# Altium project PowerDistribution.PrjPcb (part 3 of 6)

## Sheet Power Distribution - Light Load Driver.SchDoc: Light Load Driver
size Letter; Organization: Midnight Sun Solar Rayce Car Team; Address1: University of Waterloo; Address2: 200 University Ave W; Address3: Waterloo, ON, Canada; Address4: N2L 3E9; Website: www.uwmidsun.com; SheetName: Light Load Driver
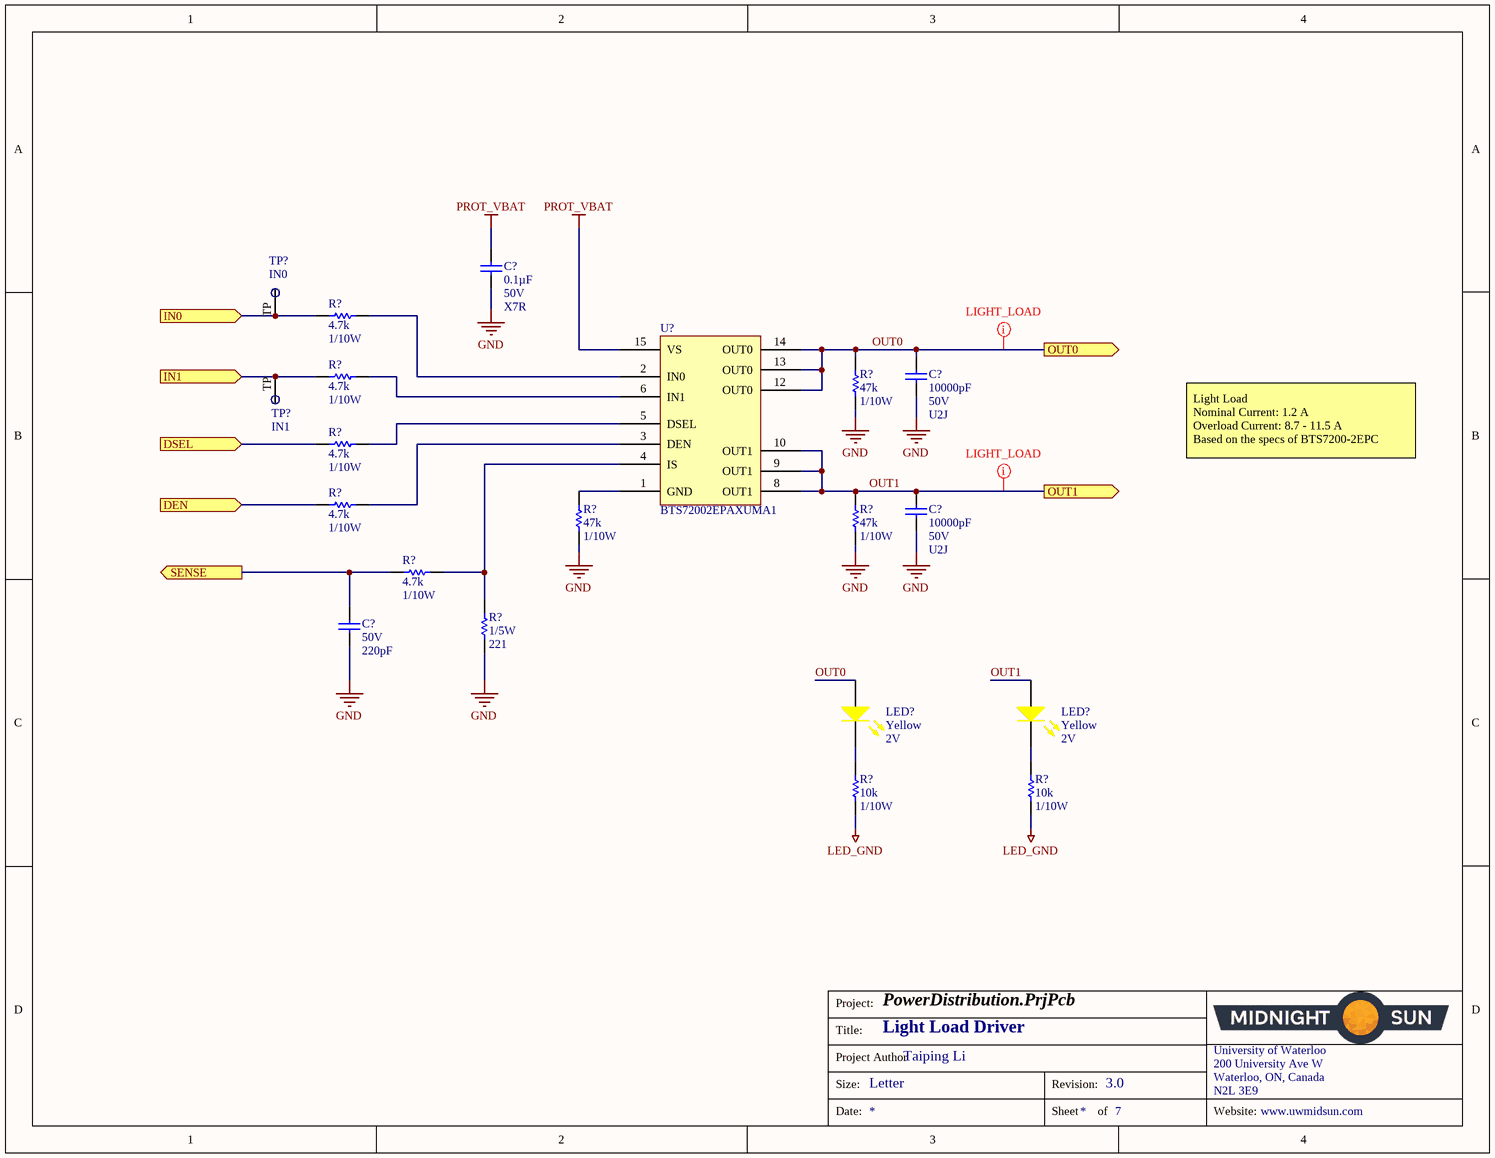
[diagram p5: Power Distribution - Light Load Driver.SchDoc]

### Parts
(Parts that share a designator on the sheet are numbered #1, #2 ... from top to bottom, then left to right.)
C?#4  Capacitance: 0.1µF  Voltage: 50V  Temperature Coefficient: X7R  [CAP, 0603]  (hidden comment: CAP CER 0.1UF 50V 10% X7R 0603)
C?#5  Capacitance: 10000pF  Voltage: 50V  Temperature Coefficient: U2J  [CAP, 0603]  (hidden comment: CAP CER 10nF 50V 5% X7R 0603)
C?#6  Capacitance: 10000pF  Voltage: 50V  Temperature Coefficient: U2J  [CAP, 0603]  (hidden comment: CAP CER 10nF 50V 5% X7R 0603)
C?#7  Voltage Rating: 50V  Capacitance: 220pF  [CAP, 0603]  (hidden comment: CAP CER 220PF 50V C0G/NP0 0603)
LED?#1  Color: Yellow  Voltage - Forward (Vf) (Typ): 2V  [LED_0603]  (hidden comment: LED YELLOW CLEAR 2.1V 0603)
LED?#2  Color: Yellow  Voltage - Forward (Vf) (Typ): 2V  [LED_0603]  (hidden comment: LED YELLOW CLEAR 2.1V 0603)
R?#3  Resistance (Ohms): 4.7k  Power (Watts): 1/10W  [RES, 0603]  (hidden comment: RES 4.7K OHM 1% 1/10W 0603)
R?#4  Resistance: 47k  Power Rating: 1/10W  [RES, 0603]  (hidden comment: RES 47K OHM 1% 1/10W 0603)
R?#5  Resistance (Ohms): 4.7k  Power (Watts): 1/10W  [RES, 0603]  (hidden comment: RES 4.7K OHM 1% 1/10W 0603)
R?#6  Resistance (Ohms): 4.7k  Power (Watts): 1/10W  [RES, 0603]  (hidden comment: RES 4.7K OHM 1% 1/10W 0603)
R?#7  Resistance: 47k  Power Rating: 1/10W  [RES, 0603]  (hidden comment: RES 47K OHM 1% 1/10W 0603)
R?#8  Resistance: 47k  Power Rating: 1/10W  [RES, 0603]  (hidden comment: RES 47K OHM 1% 1/10W 0603)
R?#9  Resistance (Ohms): 4.7k  Power (Watts): 1/10W  [RES, 0603]  (hidden comment: RES 4.7K OHM 1% 1/10W 0603)
R?#10  Resistance (Ohms): 4.7k  Power (Watts): 1/10W  [RES, 0603]  (hidden comment: RES 4.7K OHM 1% 1/10W 0603)
R?#11  Power (Watts): 1/5W  Resistance: 221  [RES, 0603]  (hidden comment: RES 221 OHM 0.1% 1/5W 0603)
R?#12  Resistance: 10k  Power: 1/10W  [RES, 0603]  (hidden comment: RES 10K OHM 1% 1/10W 0603)
R?#13  Resistance: 10k  Power: 1/10W  [RES, 0603]  (hidden comment: RES 10K OHM 1% 1/10W 0603)
TP?#2  IN0  [Test Point]  (no BOM)
TP?#3  IN1  [Test Point]  (no BOM)
U?#4  Manufacturer Part Number: BTS72002EPAXUMA1  [IC LOAD SWITCH PG-TSDSO-14-22]  (hidden comment: IC LOAD SWITCH BTS7200-2EPA PG-TSDSO-14)

### Ports
DEN (in), DSEL (in), IN0 (in), IN1 (in), OUT0 (out), OUT1 (out), SENSE (out)

### Nets
GND: C?#4.2 C?#5.2 C?#6.2 C?#7.2 R?#4.2 R?#7.2 R?#8.2 R?#11.2
LED_GND: R?#12.2 R?#13.2
PROT_VBAT: C?#4.1 U?#4.15(VS)
OUT0: C?#5.1 LED?#1.1(A) R?#4.1 U?#4.12(OUT0) U?#4.13(OUT0) U?#4.14(OUT0) ; port OUT0
OUT1: C?#6.1 LED?#2.1(A) R?#8.1 U?#4.8(OUT1) U?#4.9(OUT1) U?#4.10(OUT1) ; port OUT1
NetC?#7_1: C?#7.1 R?#10.1 ; port SENSE
NetLED?#1_2: LED?#1.2(K) R?#12.1
NetLED?#2_2: LED?#2.2(K) R?#13.1
NetR?#3_1: R?#3.1 TP?#2.TP ; port IN0
NetR?#3_2: R?#3.2 U?#4.2(IN0)
NetR?#5_1: R?#5.1 TP?#3.TP ; port IN1
NetR?#5_2: R?#5.2 U?#4.6(IN1)
NetR?#6_1: R?#6.1 ; port DSEL
NetR?#6_2: R?#6.2 U?#4.5(DSEL)
NetR?#7_1: R?#7.1 U?#4.1(GND)
NetR?#9_1: R?#9.1 ; port DEN
NetR?#9_2: R?#9.2 U?#4.3(DEN)
NetR?#10_2: R?#10.2 R?#11.1 U?#4.4(IS)

### Layout directives
mark named LIGHT_LOAD: OUT0, OUT1

### Notes on the sheet
- Light Load
  Nominal Current: 1.2 A
  Overload Current: 8.7 - 11.5 A
  Based on the specs of BTS7200-2EPC
- Project:
- Title:
- Size:
- Project Author
- Letter
- Revision:
- University of Waterloo
- 200 University Ave W
- Waterloo, ON, Canada
- N2L 3E9
- Date:
- Sheet
- of
- Website:

### Library data of the parts
C?#4 = CAP CER 0.1UF 50V 10% X7R 0603: 0.10µF ±10% 50V Ceramic Capacitor X7R 0603 (1608 Metric); Manufacturer 1: AVX Corporation; Manufacturer Part Number 1: 06035C104KAT2A; Supplier 1: Digi-Key; Supplier Part Number 1: 478-5052-1-ND; Packaging: Cut Tape (CT); Part Status: Active; Operating Temperature: -55°C ~ 125°C; Ratings: -; Mounting Type: Surface Mount, MLCC; Package / Case: 0603 (1608 Metric); Size / Dimension: 0.063" L x 0.032" W (1.60mm x 0.81mm); Height - Seated (Max): -; Thickness (Max): 0.035" (0.90mm); Lead Spacing: -; Lead Style: -; ComponentLink1URL: http://datasheets.avx.com/X7RDielectric.pdf; ComponentLink1Description: http://datasheets.avx.com/X7RDielectric.pdf; Tolerance: ±10%
C?#5 C?#6 = CAP CER 10nF 50V 5% X7R 0603: 10000pF ±5% 50V Ceramic Capacitor U2J 0603 (1608 Metric); Manufacturer 1: KEMET; Manufacturer Part Number 1: C0603C103J5JAC7867; Supplier 1: Digi-Key; Supplier Part Number 1: 399-13384-1-ND; Packaging: Cut Tape (CT); Part Status: Active; Operating Temperature: -55°C ~ 125°C; Ratings: -; Failure Rate: -; Mounting Type: Surface Mount, MLCC; Package / Case: 0603 (1608 Metric); Size / Dimension: 0.063" L x 0.032" W (1.60mm x 0.80mm); Height - Seated (Max): -; Thickness (Max): 0.034" (0.87mm); Lead Spacing: -; Lead Style: -; ComponentLink1URL: http://www.kemet.com/docfinder?Partnumber=C0603C103J5JAC7867; ComponentLink1Description: http://www.kemet.com/docfinder?Partnumber=C0603C103J5JAC7867; Tolerance: ±5%
C?#7 = CAP CER 220PF 50V C0G/NP0 0603: 220pF ±5% 50V Ceramic Capacitor C0G, NP0 0603 (1608 Metric); Manufacturer: KEMET; Manufacturer Part Number: C0603C221J5GACAUTO; Dissipation Factor: 0.1%; Supplier 1: Digi-Key; Supplier Part Number 1: 399-6868-1-ND; Stock 1: 35170; Pricing 1: 1=0.14000, 10=0.09700, 100=0.04550, 500=0.03188, 1000=0.02640 (USD); RoHS: Yes; Mount: Surface Mount; Case/Package: 0603; Case Code (Metric): 1608; Case Code (Imperial): 0603; Contact Plating: Tin; Dielectric Material: Ceramic; Min Operating Temperature: -55°C; Max Operating Temperature: 125°C; Tolerance: 5%; Packaging: Tape and Reel; Package Quantity: 1; Voltage Rating (DC): 50V; Termination: SMD/SMT; Length: 1.6mm; Height: 0.8mm; Width: 0.031inch; Thickness: 0.034inch; Depth: 0.8mm; Ratings: AEC-Q200; Radiation Hardening: No; REACH SVHC: No SVHC; Lead Free: Lead Free; ComponentLink1URL: https://datasheet.ciiva.com/18192/getdatasheetpartid-416741-18192869.pdf?src-supplier=Verical; ComponentLink1Description: https://datasheet.ciiva.com/18192/getdatasheetpartid-416741-18192869.pdf?src-supplier=Verical; ComponentLink2URL: https://datasheet.ciiva.com/22694/1633156-22694015.pdf?src-supplier=Element14; ComponentLink2Description: https://datasheet.ciiva.com/22694/1633156-22694015.pdf?src-supplier=Element14; Dielectric: C0G
LED?#1 LED?#2 = LED YELLOW CLEAR 2.1V 0603: Yellow 590nm LED Indication - Discrete 2V 0603 (1608 Metric); Manufacturer: Wurth Electronics Inc.; Manufacturer Part Number: 150060YS75000; Lens Color: Colorless; Millicandela Rating: 120mcd; Lens Style/Size: Rectangle with Flat Top, 1.10mm x 0.70mm; Current - Test: 20mA; Viewing Angle: 140°; Wavelength - Peak: 595nm; Supplier 1: Digi-Key; RoHS: RoHS Compliant; Category: Optoelectronics; Stock 1: 10523; Pricing 1: 1=0.21, 100=0.1617, 500=0.13964 (CAD); Packaging: Cut Tape (CT); Part Status: Active; Lens Transparency: Clear; Mounting Type: Surface Mount; Wavelength - Dominant: 590nm; Features: -; Package / Case: 0603 (1608 Metric); Supplier Device Package: 0603; Size / Dimension: 1.60mm L x 0.80mm W; Height (Max): 0.80mm; ComponentLink1URL: http://katalog.we-online.de/led/datasheet/150060YS75000.pdf; ComponentLink1Description: http://katalog.we-online.de/led/datasheet/150060YS75000.pdf; Supplier Part Number 1: 732-4981-1-ND
R?#3 R?#5 R?#6 R?#9 R?#10 = RES 4.7K OHM 1% 1/10W 0603: 4.7k Ohm ±1% 0.1W, 1/10W Chip Resistor 0603 (1608 Metric) Moisture Resistant Thick Film; Manufacturer 1: Yageo; Manufacturer Part Number 1: RC0603FR-074K7L; Description 1: RES SMD 4.7K OHM 1% 1/10W 0603; Temperature Coefficient: ±100ppm/°C; Supplier 1: Digi-Key; Supplier Part Number 1: 311-4.70KHRCT-ND; RoHS: RoHS Compliant; Category: Resistors; Stock 1: 3487566; Pricing 1: 1=0.16, 10=0.022, 100=0.0089, 1000=0.00402, 2500=0.00349 (CAD); Packaging: Cut Tape (CT); Part Status: Active; Composition: Thick Film; Features: Moisture Resistant; Operating Temperature: -55°C ~ 155°C; Package / Case: 0603 (1608 Metric); Supplier Device Package: 0603; Size / Dimension: 0.063" L x 0.031" W (1.60mm x 0.80mm); Height - Seated (Max): 0.022" (0.55mm); Failure Rate: -; ComponentLink1URL: http://www.yageo.com/documents/recent/PYu-RC_Group_51_RoHS_L_7.pdf; ComponentLink1Description: http://www.yageo.com/documents/recent/PYu-RC_Group_51_RoHS_L_7.pdf; Tolerance: ±1%
R?#4 R?#7 R?#8 = RES 47K OHM 1% 1/10W 0603: 47 kOhms ±1% 0.1W, 1/10W Chip Resistor 0603 (1608 Metric) Automotive AEC-Q200 Thick Film; Manufacturer: Panasonic; Manufacturer Part Number: ERJ3EKF4702V; Voltage Rating: 75V; Temperature Coefficient: 100ppm/°C; Working Voltage: 6V; Max Power Dissipation: 100mW; ComponentLink1URL: https://industrial.panasonic.com/cdbs/www-data/pdf/RDO0000/AOA0000C291.pdf; ComponentLink1Description: https://industrial.panasonic.com/cdbs/www-data/pdf/RDO0000/AOA0000C291.pdf; ComponentLink2URL: https://datasheet.ciiva.com/6138/aoa0000ce2-6138149.pdf?src-supplier=Farnell; ComponentLink2Description: https://datasheet.ciiva.com/6138/aoa0000ce2-6138149.pdf?src-supplier=Farnell; ComponentLink3URL: https://datasheet.ciiva.com/7802/aoa0000ce2-7802421.pdf?src-supplier=Element14; ComponentLink3Description: https://datasheet.ciiva.com/7802/aoa0000ce2-7802421.pdf?src-supplier=Element14; ComponentLink4URL: https://datasheet.ciiva.com/48531/aoa0000ce2-48531029.pdf?src-supplier=Avnet; ComponentLink4Description: https://datasheet.ciiva.com/48531/aoa0000ce2-48531029.pdf?src-supplier=Avnet; ComponentLink5URL: https://datasheet.ciiva.com/16514/aoa0000ce2-16514071.pdf?src-supplier=Avnet+Asia; ComponentLink5Description: https://datasheet.ciiva.com/16514/aoa0000ce2-16514071.pdf?src-supplier=Avnet+Asia; ComponentLink6URL: https://datasheet.ciiva.com/46398/1678782-46398088.pdf?src-supplier=Element14; ComponentLink6Description: https://datasheet.ciiva.com/46398/1678782-46398088.pdf?src-supplier=Element14; ComponentLink7URL: https://datasheet.ciiva.com/24069/aoa0000ce2-24069209.pdf?src-supplier=Mouser; ComponentLink7Description: https://datasheet.ciiva.com/24069/aoa0000ce2-24069209.pdf?src-supplier=Mouser; ComponentLink8URL: https://datasheet.ciiva.com/46398/1678782-46398089.pdf?src-supplier=Element14; ComponentLink8Description: https://datasheet.ciiva.com/46398/1678782-46398089.pdf?src-supplier=Element14; ComponentLink9URL: https://datasheet.ciiva.com/30236/aoa0000ce2-30236698.pdf?src-supplier=Onlinecomponents.com; ComponentLink9Description: https://datasheet.ciiva.com/30236/aoa0000ce2-30236698.pdf?src-supplier=Onlinecomponents.com; ComponentLink10URL: https://datasheet.ciiva.com/22722/426256-22722781.pdf?src-supplier=Element14; ComponentLink10Description: https://datasheet.ciiva.com/22722/426256-22722781.pdf?src-supplier=Element14; ComponentLink11URL: https://datasheet.ciiva.com/16758/70260748-16758831.pdf?src-supplier=Allied+Electronics; ComponentLink11Description: https://datasheet.ciiva.com/16758/70260748-16758831.pdf?src-supplier=Allied+Electronics; Supplier 1: Digi-Key; Stock 1: 1704740; Pricing 1: 1 = 0.100000, 10 = 0.065000, 100 = 0.026400, 1000 = 0.011860, 2500 = 0.010290 (USD); RoHS: Yes; Mount: Surface Mount; Case/Package: 0603; Number of Pins: 2; Case Code (Metric): 1608; Case Code (Imperial): 0603; Contact Plating: Tin; Min Operating Temperature: -55°C; Max Operating Temperature: 155°C; Tolerance: 1%; Packaging: Tape and Reel; Package Quantity: 1; Composition: Thick Film; Number of Terminations: 2; Termination: SMD/SMT; Military Standard: Not; Voltage Rating (DC): 75V; Features: Automotive AEC-Q200; Length: 1.6mm; Height: 0.022inch; Width: 0.031inch; Depth: 0.8mm; Radiation Hardening: No; REACH SVHC: No SVHC; Lead Free: Lead Free; Supplier Part Number 1: P47.0KHCT-ND
R?#11 = RES 221 OHM 0.1% 1/5W 0603: 221 Ohms ±0.1% 0.2W, 1/5W Chip Resistor 0603 (1608 Metric) Automotive AEC-Q200, Pulse Withstanding Thick Film; Manufacturer: Panasonic; Manufacturer Part Number: ERJ-PB3B2210V; Max Power Dissipation: 200mW; Temperature Coefficient: 50ppm/°C; Supplier 1: Digi-Key; Supplier Part Number 1: P19895CT-ND; Stock 1: 4900; Pricing 1: 1=0.25000, 10=0.21100, 25=0.15320, 50=0.11100, 100=0.08230, 250=0.06316, 500=0.04976, 1000=0.03445 (USD); RoHS: Yes; Case/Package: 0603; Case Code (Metric): 1608; Case Code (Imperial): 0603; Min Operating Temperature: -55°C; Max Operating Temperature: 155°C; Packaging: Cut Tape; Composition: Thick Film; Number of Terminations: 2; Tolerance: 0.1%; Features: Automotive AEC-Q200; Length: 0.063inch; Width: 0.032inch; Height - Seated (Max): 0.022inch; ComponentLink1URL: https://industrial.panasonic.com/cdbs/www-data/pdf/RDM0000/DMM0000COL5.pdf?src-supplier=Digi-Key; ComponentLink1Description: https://industrial.panasonic.com/cdbs/www-data/pdf/RDM0000/DMM0000COL5.pdf?src-supplier=Digi-Key; ComponentLink2URL: https://industrial.panasonic.com/sa/system/files/data/download/catalog/id_fixed-resistors_e_2.pdf?src-supplier=Digi-Key; ComponentLink2Description: https://industrial.panasonic.com/sa/system/files/data/download/catalog/id_fixed-resistors_e_2.pdf?src-supplier=Digi-Key
R?#12 R?#13 = RES 10K OHM 1% 1/10W 0603: RES SMD 10K OHM 1% 1/10W 0603; Manufacturer 1: Yageo; Manufacturer Part Number 1: RC0603FR-0710KL; Temperature Coefficient: ±100ppm/°C; Supplier 1: Digi-Key; Supplier Part Number 1: 311-10.0KHRCT-ND; Packaging: Cut Tape (CT); Part Status: Active; Composition: Thick Film; Operating Temperature: -55°C ~ 155°C; Package / Case: 0603 (1608 Metric); Supplier Device Package: 0603; Size / Dimension: 0.063" L x 0.031" W (1.60mm x 0.80mm); Height - Seated (Max): 0.022" (0.55mm); Failure Rate: -; ComponentLink1URL: http://www.yageo.com/documents/recent/PYu-RC_Group_51_RoHS_L_7.pdf; ComponentLink1Description: http://www.yageo.com/documents/recent/PYu-RC_Group_51_RoHS_L_7.pdf; Tolerance: ±1%
TP?#2 TP?#3 = Test Point
U?#4 = IC LOAD SWITCH BTS7200-2EPA PG-TSDSO-14: Power Switch/Driver 1:1 N-Channel 1.2A PG-TSDSO-14-22; Manufacturer: Infineon; Supplier 1: Digi-Key; Supplier Part Number 1: BTS72002EPAXUMA1CT-ND; Stock 1: 1973; Pricing 1: 1=1.31000, 10=1.17500, 100=0.91640, 500=0.75700, 1000=0.59763 (USD); RoHS: No; ComponentLink1Description: https://www.infineon.com/dgdl/Infineon-BTS7200-2EPA-DS-v01_00-EN.pdf?fileId=5546d462636cc8fb016421e548a61215; ComponentLink1URL: https://www.infineon.com/dgdl/Infineon-BTS7200-2EPA-DS-v01_00-EN.pdf?fileId=5546d462636cc8fb016421e548a61215

## Sheet Power Distribution - Heavy Load Driver.SchDoc
size 254 x 203 mm; Organization: Midnight Sun Solar Rayce Car Team; Address1: University of Waterloo; Address2: 200 University Ave W; Address3: Waterloo, ON, Canada; Address4: N2L 3E9; Website: www.uwmidsun.com
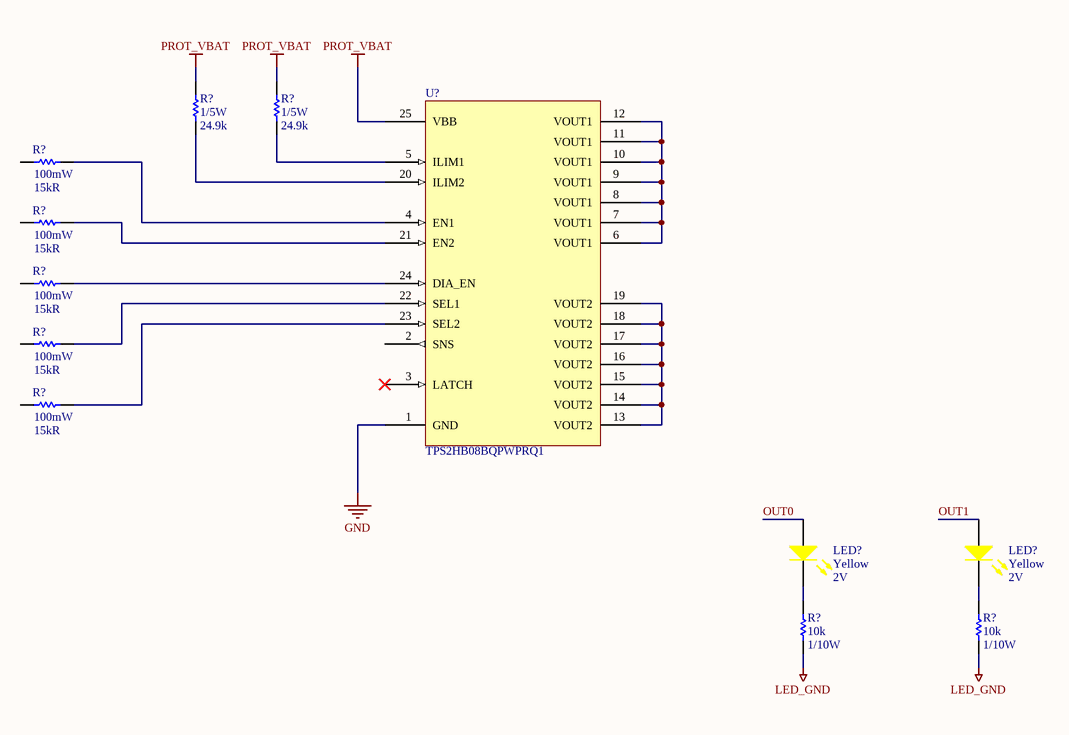
[diagram p6: Power Distribution - Heavy Load Driver.SchDoc]

### Parts
(Parts that share a designator on the sheet are numbered #1, #2 ... from top to bottom, then left to right.)
LED?#3  Color: Yellow  Voltage - Forward (Vf) (Typ): 2V  [LED_0603]  (hidden comment: LED YELLOW CLEAR 2.1V 0603)
LED?#4  Color: Yellow  Voltage - Forward (Vf) (Typ): 2V  [LED_0603]  (hidden comment: LED YELLOW CLEAR 2.1V 0603)
R?#14  Power: 1/5W  Resistance: 24.9k  [RES, 0603]  (hidden comment: RES 24.9K OHM 0.1% 1/5W 0603)
R?#15  Power: 1/5W  Resistance: 24.9k  [RES, 0603]  (hidden comment: RES 24.9K OHM 0.1% 1/5W 0603)
R?#16  Power Rating: 100mW  Resistance: 15kR  [RES, 0603]  (hidden comment: RES SMD 15K OHM 1% 1/10W 0603)
R?#17  Power Rating: 100mW  Resistance: 15kR  [RES, 0603]  (hidden comment: RES SMD 15K OHM 1% 1/10W 0603)
R?#18  Power Rating: 100mW  Resistance: 15kR  [RES, 0603]  (hidden comment: RES SMD 15K OHM 1% 1/10W 0603)
R?#19  Power Rating: 100mW  Resistance: 15kR  [RES, 0603]  (hidden comment: RES SMD 15K OHM 1% 1/10W 0603)
R?#20  Power Rating: 100mW  Resistance: 15kR  [RES, 0603]  (hidden comment: RES SMD 15K OHM 1% 1/10W 0603)
R?#21  Resistance: 10k  Power: 1/10W  [RES, 0603]  (hidden comment: RES 10K OHM 1% 1/10W 0603)
R?#22  Resistance: 10k  Power: 1/10W  [RES, 0603]  (hidden comment: RES 10K OHM 1% 1/10W 0603)
U?#5  Manufacturer Part Number: TPS2HB08BQPWPRQ1  [IC TPS2HB08-Q1 PowerPAD TSSOP-24]  (hidden comment: IC LOAD SWITCH TPS2HB08BQPWPRQ1 24-TSSOP)

### Nets
GND: U?#5.1(GND)
LED_GND: R?#21.2 R?#22.2
PROT_VBAT: R?#14.2 R?#15.2 U?#5.25(VBB)
OUT0: LED?#3.1(A)
OUT1: LED?#4.1(A)
NetLED?#3_2: LED?#3.2(K) R?#21.1
NetLED?#4_2: LED?#4.2(K) R?#22.1
NetR?#14_1: R?#14.1 U?#5.20(ILIM2)
NetR?#15_1: R?#15.1 U?#5.5(ILIM1)
NetR?#16_2: R?#16.2 U?#5.4(EN1)
NetR?#17_2: R?#17.2 U?#5.21(EN2)
NetR?#18_2: R?#18.2 U?#5.24(DIA_EN)
NetR?#19_2: R?#19.2 U?#5.22(SEL1)
NetR?#20_2: R?#20.2 U?#5.23(SEL2)
NetU?#5_6: U?#5.6(VOUT1) U?#5.7(VOUT1) U?#5.8(VOUT1) U?#5.9(VOUT1) U?#5.10(VOUT1) U?#5.11(VOUT1) U?#5.12(VOUT1)
NetU?#5_13: U?#5.13(VOUT2) U?#5.14(VOUT2) U?#5.15(VOUT2) U?#5.16(VOUT2) U?#5.17(VOUT2) U?#5.18(VOUT2) U?#5.19(VOUT2)

Not connected (* = marked no-connect by the designer): R?#16 1; R?#17 1; R?#18 1; R?#19 1; R?#20 1; U?#5 2(SNS) 3(LATCH)*

### Notes on the sheet
- Project:
- Title:
- Size:
- Project Author
- Letter
- Revision:
- University of Waterloo
- 200 University Ave W
- Waterloo, ON, Canada
- N2L 3E9
- Date:
- Sheet
- of
- Website:

### Library data of the parts
LED?#3 LED?#4 = LED YELLOW CLEAR 2.1V 0603: as LED?#1 on sheet Power Distribution - Light Load Driver; Supplier 1: Digi-Key; RoHS: RoHS Compliant; Category: Optoelectronics; Stock 1: 10523; Pricing 1: 1=0.21, 100=0.1617, 500=0.13964 (CAD); Packaging: Cut Tape (CT); Part Status: Active; Lens Transparency: Clear; Mounting Type: Surface Mount; Wavelength - Dominant: 590nm; Features: -; Package / Case: 0603 (1608 Metric); Supplier Device Package: 0603; Size / Dimension: 1.60mm L x 0.80mm W; Height (Max): 0.80mm; ComponentLink1URL: http://katalog.we-online.de/led/datasheet/150060YS75000.pdf; ComponentLink1Description: http://katalog.we-online.de/led/datasheet/150060YS75000.pdf; Supplier Part Number 1: 732-4981-1-ND
R?#14 R?#15 = RES 24.9K OHM 0.1% 1/5W 0603: 24.9 kOhms ±0.1% 0.2W, 1/5W Chip Resistor 0603 (1608 Metric) Automotive AEC-Q200, Pulse Withstanding Thick Film; Manufacturer: Panasonic; Manufacturer Part Number: ERJPB3B2492V; Max Power Dissipation: 200mW; Temperature Coefficient: 50ppm/°C; Supplier 1: Digi-Key; Supplier Part Number 1: P20129CT-ND; Stock 1: 2; Pricing 1: 1=0.25000, 10=0.21100, 25=0.15320, 50=0.11100, 100=0.08230, 250=0.06316, 500=0.04976, 1000=0.03445 (USD); RoHS: Yes; Case/Package: 0603; Case Code (Metric): 1608; Case Code (Imperial): 0603; Min Operating Temperature: -55°C; Max Operating Temperature: 155°C; Packaging: Tape and Reel; Composition: Thick Film; Number of Terminations: 2; Tolerance: 0.1%; Features: Automotive AEC-Q200; Length: 0.063inch; Width: 0.032inch; Height - Seated (Max): 0.022inch; ComponentLink1URL: http://www.farnell.com/datasheets/2286937.pdf?src-supplier=Farnell; ComponentLink1Description: http://www.farnell.com/datasheets/2286937.pdf?src-supplier=Farnell; ComponentLink2URL: https://industrial.panasonic.com/sa/system/files/data/download/catalog/id_fixed-resistors_e_2.pdf?src-supplier=Digi-Key; ComponentLink2Description: https://industrial.panasonic.com/sa/system/files/data/download/catalog/id_fixed-resistors_e_2.pdf?src-supplier=Digi-Key; ComponentLink3URL: https://industrial.panasonic.com/cdbs/www-data/pdf/RDM0000/DMM0000COL5.pdf?src-supplier=Digi-Key; ComponentLink3Description: https://industrial.panasonic.com/cdbs/www-data/pdf/RDM0000/DMM0000COL5.pdf?src-supplier=Digi-Key; ComponentLink4URL: http://www.farnell.com/datasheets/2286937.pdf?src-supplier=Newark; ComponentLink4Description: http://www.farnell.com/datasheets/2286937.pdf?src-supplier=Newark
R?#16-R?#20 = RES SMD 15K OHM 1% 1/10W 0603: 15 kOhms ±1% 0.1W, 1/10W Chip Resistor 0603 (1608 Metric) Moisture Resistant Thick Film; Manufacturer: Yageo; Manufacturer Part Number: RC0603FR-0715KL; Temperature Coefficient: 100ppm/°C; Voltage Rating (DC): 50V; Supplier 1: Digi-Key; RoHS: Yes; Stock 1: 8520111; Pricing 1: 1 = 0.10000, 10 = 0.02400, 100 = 0.00970, 1000 = 0.00437, 2500 = 0.00379 (USD); Case/Package: 0603; Number of Pins: 2; Case Code (Metric): 1608; Case Code (Imperial): 0603; Min Operating Temperature: -55°C; Max Operating Temperature: 155°C; Tolerance: 1%; Packaging: Tape and Reel; Composition: Thick Film; Package Quantity: 1; Voltage Rating: 50V; Number of Terminations: 2; Termination: SMD/SMT; Military Standard: Not; Max Power Dissipation: 100mW; Features: Moisture Resistant; Length: 1.6mm; Height: 0.022inch; Width: 0.031inch; Depth: 0.8mm; REACH SVHC: Unknown; Lead Free: Lead Free; ComponentLink1URL: http://www.yageo.com/documents/recent/PYu-RC_Group_51_RoHS_L_10.pdf; ComponentLink1Description: http://www.yageo.com/documents/recent/PYu-RC_Group_51_RoHS_L_10.pdf; ComponentLink2URL: http://www.yageo.com/documents/recent/PYu-RC_Group_51_RoHS_L_9.pdf; ComponentLink2Description: http://www.yageo.com/documents/recent/PYu-RC_Group_51_RoHS_L_9.pdf; ComponentLink3URL: https://www.verical.com/server-webapp/html/getDatasheet?partID=327895; ComponentLink3Description: https://www.verical.com/server-webapp/html/getDatasheet?partID=327895; Supplier Part Number 1: 311-15.0KHRCT-ND
R?#21 R?#22 = RES 10K OHM 1% 1/10W 0603: as R?#12 on sheet Power Distribution - Light Load Driver; Supplier 1: Digi-Key; Supplier Part Number 1: 311-10.0KHRCT-ND; Packaging: Cut Tape (CT); Part Status: Active; Composition: Thick Film; Operating Temperature: -55°C ~ 155°C; Package / Case: 0603 (1608 Metric); Supplier Device Package: 0603; Size / Dimension: 0.063" L x 0.031" W (1.60mm x 0.80mm); Height - Seated (Max): 0.022" (0.55mm); Failure Rate: -; ComponentLink1URL: http://www.yageo.com/documents/recent/PYu-RC_Group_51_RoHS_L_7.pdf; ComponentLink1Description: http://www.yageo.com/documents/recent/PYu-RC_Group_51_RoHS_L_7.pdf; Tolerance: ±1%
U?#5 = IC LOAD SWITCH TPS2HB08BQPWPRQ1 24-TSSOP: Power Switch ICs - Power Distribution HYDRA 8 MOHM OTP B; Manufacturer: Texas Instruments; Supplier 1: Mouser; Supplier Part Number 1: 595-TPS2HB08BQPWPRQ1; Stock 1: 1455; Pricing 1: 1=6.26000, 10=5.63000, 50=5.63000, 100=4.61000, 1000=3.31000, 10000=3.14000 (USD); ComponentLink1URL: https://octopart.com/click/track?ak=2673a2b2&ct=datasheets&sig=00f1c14&at=physicalpart&sid=370&ppid=97400712&hlid=26833906&src-supplier=TI+store; ComponentLink1Description: https://octopart.com/click/track?ak=2673a2b2&ct=datasheets&sig=00f1c14&at=physicalpart&sid=370&ppid=97400712&hlid=26833906&src-supplier=TI+store; ComponentLink2URL: http://sigma.octopart.com/49250897/technical_drawing/Texas-Instruments-TPS2HB08BQPWPRQ1.pdf?src-supplier=TI+store; ComponentLink2Description: http://sigma.octopart.com/49250897/technical_drawing/Texas-Instruments-TPS2HB08BQPWPRQ1.pdf?src-supplier=TI+store

## Sheet Power Distribution - PJB.SchDoc: Outputs to PJB
size Letter; Organization: Midnight Sun Solar Rayce Car Team; Address1: University of Waterloo; Address2: 200 University Ave W; Address3: Waterloo, ON, Canada; Address4: N2L 3E9; DocumentNumber: 7; SheetNumber: 7; SheetTotal: 10; Website: www.uwmidsun.com
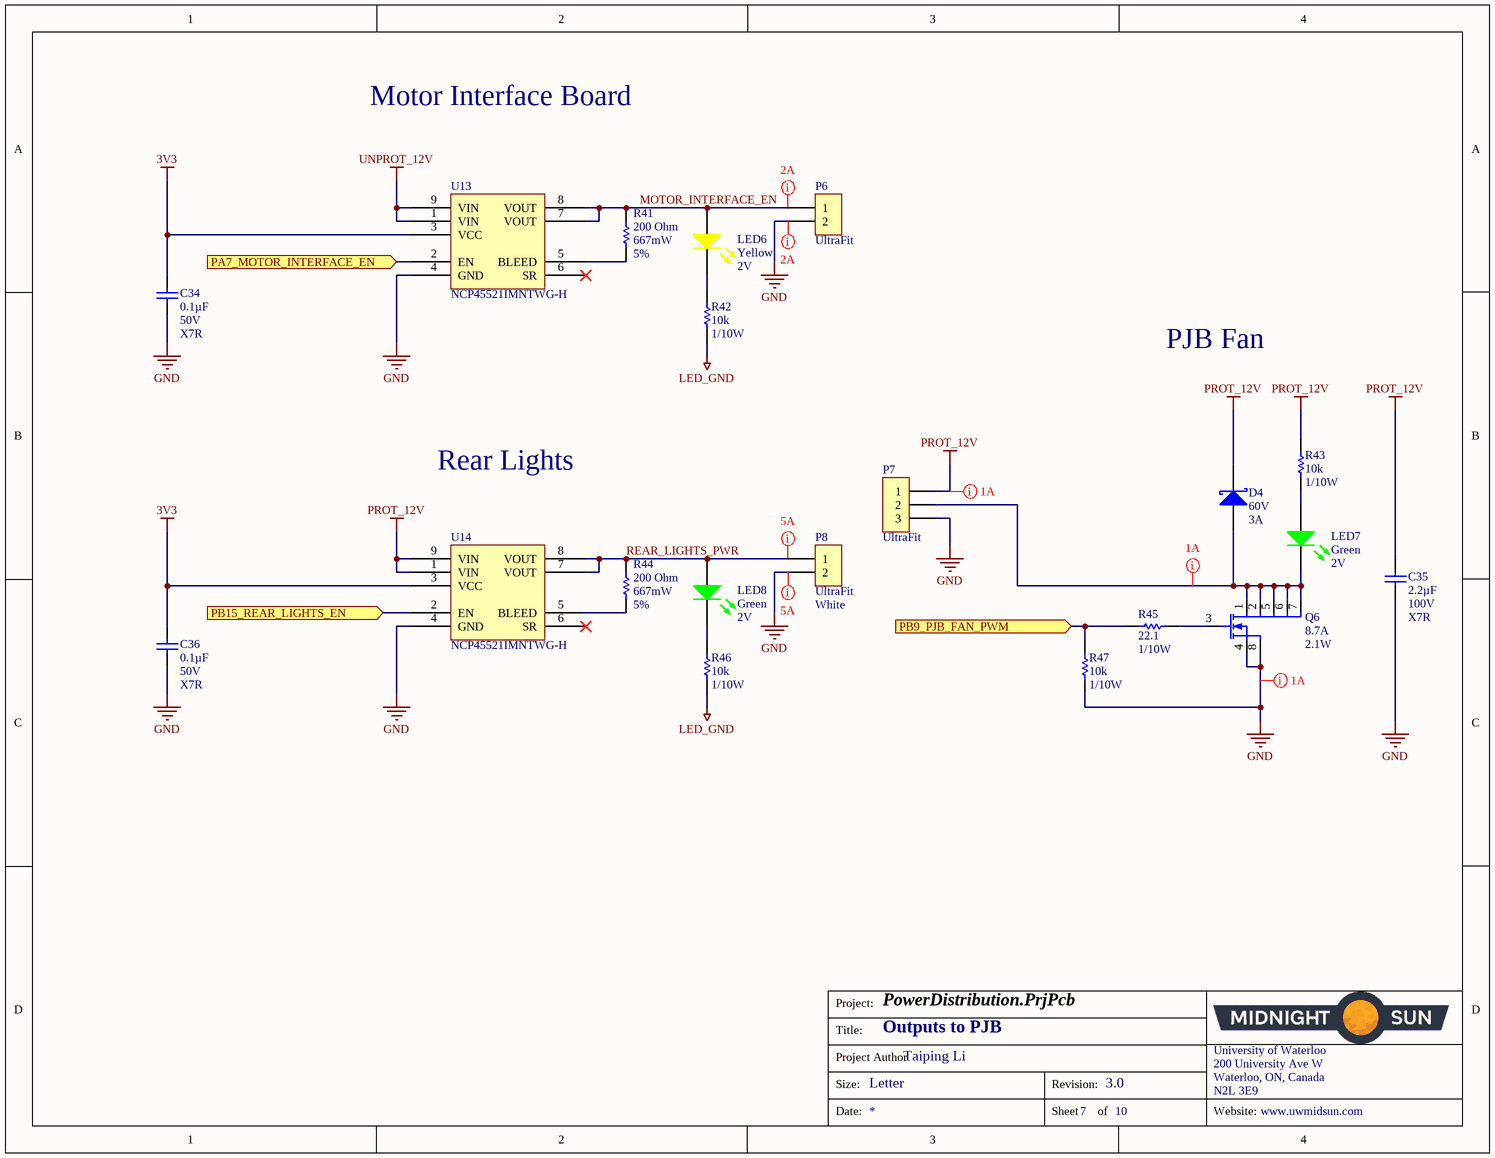
[diagram p7: Power Distribution - PJB.SchDoc]

### Parts
C34  Capacitance: 0.1µF  Voltage: 50V  Temperature Coefficient: X7R  [CAP, 0603]  (hidden comment: CAP CER 0.1UF 50V 10% X7R 0603)
C35  Capacitance: 2.2µF  Voltage: 100V  Temperature Coefficient: X7R  [CAP, 1206]  (hidden comment: CAP CER 2.2UF 100V ±20% X7R 1206)
C36  Capacitance: 0.1µF  Voltage: 50V  Temperature Coefficient: X7R  [CAP, 0603]  (hidden comment: CAP CER 0.1UF 50V 10% X7R 0603)
D4  Voltage - DC Reverse (Vr) (Max): 60V  Current - Average Rectified (Io): 3A  [Diode, SMA]  (hidden comment: DIODE SCHOTTKY 60V 3A SMA)
LED6  Color: Yellow  Voltage - Forward (Vf) (Typ): 2V  [LED_0603]  (hidden comment: LED YELLOW CLEAR 2.1V 0603)
LED7  Color: Green  Voltage - Forward (Vf) (Typ): 2V  [LED_0603]  (hidden comment: LED GREEN CLEAR 2V 0603)
LED8  Color: Green  Voltage - Forward (Vf) (Typ): 2V  [LED_0603]  (hidden comment: LED GREEN CLEAR 2V 0603)
P6  Series: UltraFit  [CONN, 2POS ULTRA-FIT]  (hidden comment: CONN 2POS ULTRA-FIT 0.138")
P7  Series: UltraFit  (hidden comment: CONN 3POS ULTRA-FIT 0.138")
P8  Series: UltraFit  Color: White  [CONN, 2POS ULTRA-FIT - NATURAL COLOR]  (hidden comment: CONN 2POS ULTRA-FIT NATURAL COLOR 0.138")
Q6  Current - Continuous Drain (Id) @ 25°C: 8.7A  Power Dissipation (Max): 2.1W  [MOSFET N-CH 30V 12A 2mmx2mm PQFN]  (hidden comment: MOSFET N-CH 30V 8.7A 2.1W 6-PQFN (2x2))
R41  200 Ohm  Tolerance: 5%  Max Power Dissipation: 667mW  [RES 1206]
R42  Resistance: 10k  Power: 1/10W  [RES, 0603]  (hidden comment: RES 10K OHM 1% 1/10W 0603)
R43  Resistance: 10k  Power: 1/10W  [RES, 0603]  (hidden comment: RES 10K OHM 1% 1/10W 0603)
R44  200 Ohm  Tolerance: 5%  Max Power Dissipation: 667mW  [RES 1206]
R45  Resistance: 22.1  Power: 1/10W  [RES, 0603]  (hidden comment: RES 22.1 OHM 1% 1/10W 0603)
R46  Resistance: 10k  Power: 1/10W  [RES, 0603]  (hidden comment: RES 10K OHM 1% 1/10W 0603)
R47  Resistance: 10k  Power: 1/10W  [RES, 0603]  (hidden comment: RES 10K OHM 1% 1/10W 0603)
U13  IC LOAD SWITCH ACT-HI 10.5A 8DFN  [IC LOAD SWITCH ACT-HI 10.5A 8DFN]  (value not drawn)
U14  IC LOAD SWITCH ACT-HI 10.5A 8DFN  [IC LOAD SWITCH ACT-HI 10.5A 8DFN]  (value not drawn)

### Ports
PA7_MOTOR_INTERFACE_EN (in), PB9_PJB_FAN_PWM (in), PB15_REAR_LIGHTS_EN (in)

### Nets
3V3: C34.1 C36.1 U13.3(VCC) U14.3(VCC)
GND: C34.2 C35.2 C36.2 P6.2 P7.3 P8.2 Q6.4(S) Q6.8(S) R47.2 U13.4(GND) U14.4(GND)
LED_GND: R42.2 R46.2
PROT_12V: C35.1 D4.2 P7.1 R43.1 U14.1(VIN) U14.9(VIN)
UNPROT_12V: U13.1(VIN) U13.9(VIN)
MOTOR_INTERFACE_EN: LED6.1(A) P6.1 R41.1 U13.7(VOUT) U13.8(VOUT)
REAR_LIGHTS_PWR: LED8.1(A) P8.1 R44.1 U14.7(VOUT) U14.8(VOUT)
NetD4_1: D4.1 LED7.2(K) P7.2 Q6.1(D) Q6.2(D) Q6.5(D) Q6.6(D) Q6.7(D)
NetLED6_2: LED6.2(K) R42.1
NetLED7_1: LED7.1(A) R43.2
NetLED8_2: LED8.2(K) R46.1
NetQ6_3: Q6.3(G) R45.1
NetR41_2: R41.2 U13.5(BLEED)
NetR44_2: R44.2 U14.5(BLEED)
NetR45_2: R45.2 R47.1 ; port PB9_PJB_FAN_PWM
NetU13_2: U13.2(EN) ; port PA7_MOTOR_INTERFACE_EN
NetU14_2: U14.2(EN) ; port PB15_REAR_LIGHTS_EN

Not connected (* = marked no-connect by the designer): U13 6(SR)*; U14 6(SR)*

### Layout directives
net class HighCurrent; rule Power Plane Connect Style [Style - Direct Connect]; rule Polygon Connect Style [Style - Direct Connect]: GND, MOTOR_INTERFACE_EN, NetD4_1, PROT_12V, REAR_LIGHTS_PWR

### Notes on the sheet
- Motor Interface Board
- PJB Fan
- Rear Lights
- Project:
- Title:
- Size:
- Project Author
- Letter
- Revision:
- University of Waterloo
- 200 University Ave W
- Waterloo, ON, Canada
- N2L 3E9
- Date:
- Sheet
- of
- Website:

### Library data of the parts
C34 C36 = CAP CER 0.1UF 50V 10% X7R 0603: as C?#4 on sheet Power Distribution - Light Load Driver; Supplier 1: Digi-Key; Supplier Part Number 1: 478-5052-1-ND; Packaging: Cut Tape (CT); Part Status: Active; Operating Temperature: -55°C ~ 125°C; Ratings: -; Mounting Type: Surface Mount, MLCC; Package / Case: 0603 (1608 Metric); Size / Dimension: 0.063" L x 0.032" W (1.60mm x 0.81mm); Height - Seated (Max): -; Thickness (Max): 0.035" (0.90mm); Lead Spacing: -; Lead Style: -; ComponentLink1URL: http://datasheets.avx.com/X7RDielectric.pdf; ComponentLink1Description: http://datasheets.avx.com/X7RDielectric.pdf; Tolerance: ±10%
C35 = CAP CER 2.2UF 100V ±20% X7R 1206: 2.2µF ±20% 100V Ceramic Capacitor X7R 1206 (3216 Metric); Manufacturer 1: Murata Electronics North America; Manufacturer Part Number 1: GRM31CR72A225MA73L; Supplier 1: Digi-Key; Supplier Part Number 1: 490-12773-1-ND; Packaging: Cut Tape (CT); Part Status: Active; Operating Temperature: -55°C ~ 125°C; Ratings: -; Mounting Type: Surface Mount, MLCC; Package / Case: 1206 (3216 Metric); Size / Dimension: 0.126" L x 0.063" W (3.20mm x 1.60mm); Height - Seated (Max): -; Thickness (Max): 0.071" (1.80mm); Lead Spacing: -; Lead Style: -; ComponentLink1URL: http://www.murata.com/~/media/webrenewal/support/library/catalog/products/capacitor/mlcc/c02e.ashx; ComponentLink1Description: http://www.murata.com/~/media/webrenewal/support/library/catalog/products/capacitor/mlcc/c02e.ashx; Tolerance: ±20%
D4 = DIODE SCHOTTKY 60V 3A SMA: Diode Schottky 60V 3A Surface Mount SMA; Manufacturer 1: Diodes Incorporated; Manufacturer Part Number 1: B360A-13-F; Voltage - Forward (Vf) (Max) @ If: 700mV @ 3A; Speed: Fast Recovery =< 500ns, > 200mA (Io); Current - Reverse Leakage @ Vr: 500µA @ 60V; Capacitance @ Vr, F: 200pF @ 4V, 1MHz; Supplier 1: Digi-Key; Supplier Part Number 1: B360A-FDICT-ND; Packaging: Cut Tape (CT); Part Status: Active; Diode Type: Schottky; Mounting Type: Surface Mount; Package / Case: DO-214AC, SMA; Supplier Device Package: SMA; Operating Temperature - Junction: -55°C ~ 150°C; ComponentLink1URL: https://www.diodes.com/assets/Datasheets/ds30891.pdf; ComponentLink1Description: https://www.diodes.com/assets/Datasheets/ds30891.pdf
LED6 = LED YELLOW CLEAR 2.1V 0603: as LED?#1 on sheet Power Distribution - Light Load Driver; Supplier 1: Digi-Key; RoHS: RoHS Compliant; Category: Optoelectronics; Stock 1: 10523; Pricing 1: 1=0.21, 100=0.1617, 500=0.13964 (CAD); Packaging: Cut Tape (CT); Part Status: Active; Lens Transparency: Clear; Mounting Type: Surface Mount; Wavelength - Dominant: 590nm; Features: -; Package / Case: 0603 (1608 Metric); Supplier Device Package: 0603; Size / Dimension: 1.60mm L x 0.80mm W; Height (Max): 0.80mm; ComponentLink1URL: http://katalog.we-online.de/led/datasheet/150060YS75000.pdf; ComponentLink1Description: http://katalog.we-online.de/led/datasheet/150060YS75000.pdf; Supplier Part Number 1: 732-4981-1-ND
LED7 LED8 = LED GREEN CLEAR 2V 0603: Green 572nm LED Indication - Discrete 2V 0603 (1608 Metric); Manufacturer: Wurth Electronics Inc.; Manufacturer Part Number: 150060VS75000; Lens Color: Colorless; Millicandela Rating: 40mcd; Lens Style/Size: Rectangle with Flat Top, 1.10mm x 0.70mm; Current - Test: 20mA; Viewing Angle: 140°; Wavelength - Dominant: 570nm; Supplier 1: Digi-Key; RoHS: RoHS Compliant; Category: Optoelectronics; Stock 1: 9408; Pricing 1: 1=0.21, 100=0.1617, 500=0.13964 (CAD); Packaging: Cut Tape (CT); Part Status: Active; Lens Transparency: Clear; Mounting Type: Surface Mount; Wavelength - Peak: 572nm; Features: -; Package / Case: 0603 (1608 Metric); Supplier Device Package: 0603; Size / Dimension: 1.60mm L x 0.80mm W; Height (Max): 0.80mm; ComponentLink1URL: http://katalog.we-online.de/led/datasheet/150060VS75000.pdf; ComponentLink1Description: http://katalog.we-online.de/led/datasheet/150060VS75000.pdf; Supplier Part Number 1: 732-4980-1-ND
P6 = CONN 2POS ULTRA-FIT 0.138": 2 Positions Header, Shrouded Connector 0.138" (3.50mm) Through Hole Gold; Manufacturer 1: Molex, LLC; Manufacturer Part Number 1: 1722861302; Style: Board to Board or Cable; Shrouding: Shrouded - 4 Wall; Number of Positions: 2; Number of Positions Loaded: All; Contact Length - Post: 0.126" (3.20mm); Material Flammability Rating: UL94 V-0; Mated Stacking Heights: 26.99mm; Voltage: 400V; Supplier 1: Digi-Key; Supplier Part Number 1: WM11673-ND; Packaging: Tray; Part Status: Active; Connector Type: Header; Contact Type: Male Pin; Pitch - Mating: 0.138" (3.50mm); Number of Rows: 1; Row Spacing - Mating: -; Mounting Type: Through Hole; Termination: Kinked Pin, Solder; Fastening Type: Latch Holder; Contact Length - Mating: -; Overall Contact Length: -; Insulation Height: 0.465" (11.80mm); Contact Shape: Square; Contact Finish - Mating: Gold; Contact Finish Thickness - Mating: 30µin (0.76µm); Contact Finish - Post: Tin; Contact Material: Copper Alloy; Insulation Material: Liquid Crystal Polymer (LCP); Operating Temperature: -40°C ~ 120°C; Ingress Protection: -; Insulation Color: Black; Current Rating: -; Contact Finish Thickness - Post: 60µin (1.52µm); ComponentLink1URL: http://www.molex.com/pdm_docs/sd/1722861302_sd.pdf; ComponentLink1Description: http://www.molex.com/pdm_docs/sd/1722861302_sd.pdf
P7 = CONN 3POS ULTRA-FIT 0.138": 3 Positions Header Connector 0.138" (3.50mm) Through Hole Tin; Manufacturer 1: Molex, LLC; Manufacturer Part Number 1: 1722871103; Style: Board to Cable/Wire; Shrouding: Shrouded - 4 Wall; Number of Positions: 3; Number of Positions Loaded: All; Contact Length - Post: 0.126" (3.20mm); Material Flammability Rating: UL94 V-0; Mated Stacking Heights: 26.99mm; Voltage: 400V; Supplier 1: Digi-Key; Supplier Part Number 1: WM11702-ND; Packaging: Tray; Part Status: Active; Connector Type: Header; Contact Type: Male Pin; Pitch - Mating: 0.138" (3.50mm); Number of Rows: 1; Row Spacing - Mating: -; Mounting Type: Through Hole; Termination: Solder; Fastening Type: Latch Holder; Contact Length - Mating: -; Overall Contact Length: -; Insulation Height: 0.465" (11.80mm); Contact Shape: Square; Contact Finish - Mating: Tin; Contact Finish Thickness - Mating: 60µin (1.52µm); Contact Finish - Post: Tin; Contact Material: Copper Alloy; Insulation Material: Liquid Crystal Polymer (LCP); Operating Temperature: -40°C ~ 105°C; Ingress Protection: -; Insulation Color: Black; Current Rating: -; Contact Finish Thickness - Post: 60µin (1.52µm); ComponentLink1URL: http://www.molex.com/pdm_docs/sd/1722871103_sd.pdf; ComponentLink1Description: http://www.molex.com/pdm_docs/sd/1722871103_sd.pdf
P8 = CONN 2POS ULTRA-FIT NATURAL COLOR 0.138": 2 Positions Header, Shrouded Connector 0.138" (3.50mm) Through Hole; Manufacturer 1: Molex, LLC; Manufacturer Part Number 1: 1722872102; Style: Board to Cable/Wire; Shrouding: Shrouded - 4 Wall; Number of Positions: 2; Number of Positions Loaded: All; Contact Length - Post: 0.126" (3.20mm); Material Flammability Rating: UL94 V-0; Mated Stacking Heights: 26.99mm; Voltage: 400V; Supplier 1: Digi-Key; Supplier Part Number 1: WM11722-ND; Packaging: Tray; Part Status: Active; Connector Type: Header; Contact Type: Male Pin; Pitch - Mating: 0.138" (3.50mm); Number of Rows: 1; Row Spacing - Mating: -; Mounting Type: Through Hole; Termination: Solder; Fastening Type: Latch Holder; Contact Length - Mating: -; Overall Contact Length: -; Insulation Height: 0.465" (11.80mm); Contact Shape: Square; Contact Finish - Mating: Tin; Contact Finish Thickness - Mating: 60µin (1.52µm); Contact Finish - Post: Tin; Contact Material: Copper Alloy; Insulation Material: Liquid Crystal Polymer (LCP); Operating Temperature: -40°C ~ 105°C; Ingress Protection: -; Insulation Color: Natural; Current Rating: -; Contact Finish Thickness - Post: 60µin (1.52µm); ComponentLink1URL: http://www.molex.com/pdm_docs/sd/1722872102_sd.pdf; ComponentLink1Description: http://www.molex.com/pdm_docs/sd/1722872102_sd.pdf
Q6 = MOSFET N-CH 30V 8.7A 2.1W 6-PQFN (2x2): Manufacturer 1: Infineon Technologies; Manufacturer Part Number 1: IRLHS6342TRPBF; Description 1: MOSFET N-CH 30V 8.7A 2X2 PQFN; FET Type: N-Channel; Drive Voltage (Max Rds On,  Min Rds On): 2.5V, 4.5V; Vgs(th) (Max) @ Id: 1.1V @ 10µA; Gate Charge (Qg) (Max) @ Vgs: 11nC @ 4.5V; Input Capacitance (Ciss) (Max) @ Vds: 1019pF @ 25V; Vgs (Max): ±12V; Rds On (Max) @ Id, Vgs: 15.5 mOhm @ 8.5A, 4.5V; Supplier 1: Digi-Key; Supplier Part Number 1: IRLHS6342TRPBFCT-ND; RoHS: RoHS Compliant; Category: Discrete Semiconductor Products; Stock 1: 9984; Pricing 1: 1=0.79, 10=0.685, 100=0.5118, 500=0.4022, 1000=0.31079 (CAD); Packaging: Cut Tape (CT); Part Status: Active; Technology: MOSFET (Metal Oxide); Drain to Source Voltage (Vdss): 30V; FET Feature: -; Operating Temperature: -55°C ~ 150°C (TJ); Mounting Type: Surface Mount; Supplier Device Package: 6-PQFN (2x2); Package / Case: 6-PowerVDFN; ComponentLink1URL: http://www.infineon.com/dgdl/irlhs6342pbf.pdf?fileId=5546d462533600a401535663b52625ad; ComponentLink1Description: http://www.infineon.com/dgdl/irlhs6342pbf.pdf?fileId=5546d462533600a401535663b52625ad
R41 R44 = RES 200 OHM 5% 2/3W 1206: 200 Ohms ±5% 0.667W, 2/3W Chip Resistor 1206 (3216 Metric) Automotive AEC-Q200, Pulse Withstanding Thick Film; Manufacturer: Panasonic; Manufacturer Part Number: ERJ-P08J201V; Voltage Rating: 500V; Resistance: 200R; Power Rating: 660mW; Temperature Coefficient: 200ppm/°C; Voltage Rating (DC): 200V; Supplier 1: Digi-Key; Stock 1: 32165; Pricing 1: 1=0.16, 10=0.137, 100=0.0534, 1000=0.02237, 2500=0.02051 (USD); Mount: Surface Mount; Case/Package: 1206; Case Code (Imperial): 1206; Case Code (Metric): 3216; Contact Plating: Tin; Min Operating Temperature: -55°C; Max Operating Temperature: 155°C; Packaging: Tape and Reel; Package Quantity: 1; Termination: SMD/SMT; Composition: Thick Film; Number of Terminations: 2; Length: 3.2mm; Height: 0.028inch; Width: 1.6mm; Radiation Hardening: No; Lead Free: Contains Lead; ComponentLink1URL: https://datasheet.ciiva.com/17207/aoa0000ce4-17207029.pdf; ComponentLink1Description: https://datasheet.ciiva.com/17207/aoa0000ce4-17207029.pdf; ComponentLink2URL: https://datasheet.ciiva.com/9184/aoa0000ce4-9184599.pdf; ComponentLink2Description: https://datasheet.ciiva.com/9184/aoa0000ce4-9184599.pdf; ComponentLink3URL: https://datasheet.ciiva.com/9184/aoa0000ce4-9184603.pdf; ComponentLink3Description: https://datasheet.ciiva.com/9184/aoa0000ce4-9184603.pdf; ComponentLink4URL: https://datasheet.ciiva.com/30201/aoa0000ce4-30201485.pdf; ComponentLink4Description: https://datasheet.ciiva.com/30201/aoa0000ce4-30201485.pdf; Supplier Part Number 1: P200ALCT-ND
R42 R43 R46 R47 = RES 10K OHM 1% 1/10W 0603: as R?#12 on sheet Power Distribution - Light Load Driver; Supplier 1: Digi-Key; Supplier Part Number 1: 311-10.0KHRCT-ND; Packaging: Cut Tape (CT); Part Status: Active; Composition: Thick Film; Operating Temperature: -55°C ~ 155°C; Package / Case: 0603 (1608 Metric); Supplier Device Package: 0603; Size / Dimension: 0.063" L x 0.031" W (1.60mm x 0.80mm); Height - Seated (Max): 0.022" (0.55mm); Failure Rate: -; ComponentLink1URL: http://www.yageo.com/documents/recent/PYu-RC_Group_51_RoHS_L_7.pdf; ComponentLink1Description: http://www.yageo.com/documents/recent/PYu-RC_Group_51_RoHS_L_7.pdf; Tolerance: ±1%
R45 = RES 22.1 OHM 1% 1/10W 0603: 22.1 Ohm ±1% 0.1W, 1/10W Chip Resistor 0603 (1608 Metric) Moisture Resistant Thick Film; Manufacturer 1: Yageo; Manufacturer Part Number 1: RC0603FR-0722R1L; Temperature Coefficient: ±100ppm/°C; Supplier 1: Digi-Key; Supplier Part Number 1: 311-22.1HRCT-ND; Packaging: Cut Tape (CT); Part Status: Active; Composition: Thick Film; Operating Temperature: -55°C ~ 155°C; Package / Case: 0603 (1608 Metric); Supplier Device Package: 0603; Size / Dimension: 0.063" L x 0.031" W (1.60mm x 0.80mm); Height - Seated (Max): 0.022" (0.55mm); Failure Rate: -; ComponentLink1URL: http://www.yageo.com/documents/recent/PYu-RC_Group_51_RoHS_L_7.pdf; ComponentLink1Description: http://www.yageo.com/documents/recent/PYu-RC_Group_51_RoHS_L_7.pdf; Tolerance: ±1%
U13 U14 = IC LOAD SWITCH ACT-HI 10.5A 8DFN: NCP45521IMNTWG-H; Manufacturer: ON Semiconductor; Switch Type: General Purpose; Number of Outputs: 1; Ratio - Input:Output: 1:1; Output Configuration: High Side; Output Type: N-Channel; Interface: On/Off; Voltage - Load: 0.5 V ~ 13.5 V; Voltage - Supply (Vcc/Vdd): 3 V ~ 5.5 V; Rds On (Typ): 12.8 mOhm; Input Type: Non-Inverting; Fault Protection: Over Temperature, UVLO; Manufacturer Part Number: NCP45521IMNTWG-H; RoHS: RoHS Compliant; Category: Integrated Circuits (ICs); Packaging: Digi-Reel®; Part Status: Active; Current - Output (Max): 10.5A; Features: Slew Rate Controlled; Operating Temperature: -40°C ~ 85°C (TA); Package / Case: 8-VFDFN Exposed Pad; Supplier Device Package: 8-DFN (2x2); ComponentLink1URL: http://www.onsemi.com/pub/Collateral/NCP45520-D.PDF; ComponentLink1Description: http://www.onsemi.com/pub/Collateral/NCP45520-D.PDF; Supplier 1: Digi-Key; Stock 1: 2377; Pricing 1: 1=1.57, 10=1.405, 100=1.0957, 500=0.90518, 1000=0.71462 (CAD); Supplier 2: Digi-Key; Stock 2: 2211; Pricing 2: 1=1.53, 10=1.372, 100=1.0702, 500=0.88408, 1000=0.69797 (CAD); Supplier Part Number 2: NCP45521IMNTWG-HOSDKR-ND